# Altium schematic sheet 3V0_reference.SchDoc: 3.0V Reference
size A4
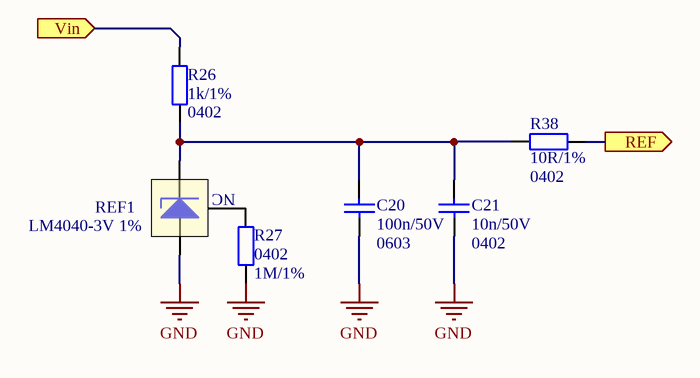
[diagram p0: 3V0_reference.SchDoc]

## Parts
C20  Package: 0603  [SMD_Capacitor_0603]  (hidden comment: 100n/50V)
C21  Package: 0402  [SMD_Capacitor_0402]  (hidden comment: 10n/50V)
R26  Package: 0402  [SMD_Resistor_0402]  (hidden comment: 1k/1%)
R27  Package: 0402  [SMD_Resistor_0402]  (hidden comment: 1M/1%)
R38  Package: 0402  [SMD_Resistor_0402]  (hidden comment: 10R/1%)
REF1  LM4040-3V 1%  [SOT23-3]

## Ports
REF (out), Vin (in)

## Nets
GND: C20.2 C21.2 R27.2 REF1.2(A)
REF: R38.2 ; port REF
Vin: R26.1 ; port Vin
NetC20_1: C20.1 C21.1 R26.2 R38.1 REF1.1(K)
NetR27_1: R27.1 REF1.3(NC)

## Notes on the sheet
- Title:
- Sheet:
- of
- Author:
- Model:
- Document Number:
- Checked by:
- Iss-Rev:
- Approved by:
- Date:
- File name:

## Library data of the parts
C20 = Cer_C0603T104K5RALTU: Ceramic Cap Kemet COTS 100n/50V X7R 0603; Manufacturer: Kemet; ManufacturerPartNumber: C0603T104K5RALTU; Value: 100n/50V
C21 = Cer_C0402T103K5RALTU: Ceramic Cap Kemet COTS 10n/50V X7R 0402; ManufacturerPartNumber: C0402T103K5RALTU; Manufacturer: Kemet; Value: 10n/50V
R26 = CRCW04021K00FKxxxx: 1k/1% Vishay CRCW 0402 Resistor. 63mW, 100ppm, 50V.; Manufacturer: Vishay; ManufacturerPartNumber: CRCW04021K00FKxxxx; Value: 1k/1%
R27 = CRCW04021M00FKxxxx: 1M/1% Vishay CRCW 0402 Resistor. 63mW, 100ppm, 50V.; Manufacturer: Vishay; ManufacturerPartNumber: CRCW04021M00FKxxxx; Value: 1M/1%
R38 = CRCW040210R0FKxxxx: 10R/1% Vishay CRCW 0402 Resistor. 63mW, 100ppm, 50V.; Manufacturer: Vishay; ManufacturerPartNumber: CRCW040210R0FKxxxx; Value: 10R/1%
REF1 = LM4040DIM3-3.0: Shunt V-REF, 3V, 1%, SOT23-3; Manufacturer: Texas Instruments; ManufacturerPartNumber: LM4040DIM3-3.0; Value: LM4040-3V 1%